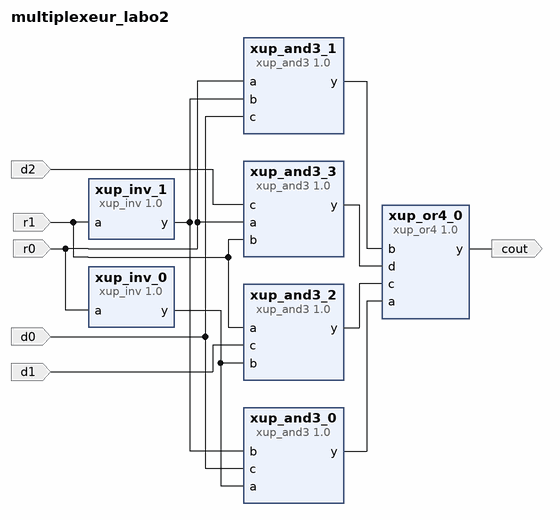
[diagram p0: block diagram of the top level]
# Vivado block design multiplexeur_labo2, xc7a100tcsg324-1, Vivado 2018.3
create_bd_design multiplexeur_labo2

create_bd_port -dir I r0
create_bd_port -dir I r1
create_bd_port -dir I d0
create_bd_port -dir I d1
create_bd_port -dir I d2
create_bd_port -dir O cout

create_bd_cell -type ip -vlnv xilinx.com:xup:xup_and3:1.0 xup_and3_0
create_bd_cell -type ip -vlnv xilinx.com:xup:xup_and3:1.0 xup_and3_1
create_bd_cell -type ip -vlnv xilinx.com:xup:xup_and3:1.0 xup_and3_2
create_bd_cell -type ip -vlnv xilinx.com:xup:xup_and3:1.0 xup_and3_3
create_bd_cell -type ip -vlnv xilinx.com:xup:xup_inv:1.0 xup_inv_0
create_bd_cell -type ip -vlnv xilinx.com:xup:xup_inv:1.0 xup_inv_1
create_bd_cell -type ip -vlnv xilinx.com:xup:xup_or4:1.0 xup_or4_0

# ---- connections ----

connect_bd_net -net r0_1 [get_bd_ports r0] [get_bd_pins xup_inv_0/a] [get_bd_pins xup_and3_3/a] [get_bd_pins xup_and3_1/a]
connect_bd_net [get_bd_pins xup_inv_1/y] [get_bd_pins xup_and3_0/b] [get_bd_pins xup_and3_1/b]
connect_bd_net -net d0_1 [get_bd_ports d0] [get_bd_pins xup_and3_0/c] [get_bd_pins xup_and3_1/c]
connect_bd_net -net d1_1 [get_bd_ports d1] [get_bd_pins xup_and3_2/c]
connect_bd_net -net d2_1 [get_bd_ports d2] [get_bd_pins xup_and3_3/c]
connect_bd_net [get_bd_pins xup_and3_0/y] [get_bd_pins xup_or4_0/a]
connect_bd_net [get_bd_pins xup_and3_1/y] [get_bd_pins xup_or4_0/b]
connect_bd_net [get_bd_pins xup_and3_2/y] [get_bd_pins xup_or4_0/c]
connect_bd_net [get_bd_pins xup_and3_3/y] [get_bd_pins xup_or4_0/d]
connect_bd_net [get_bd_pins xup_or4_0/y] [get_bd_ports cout]
connect_bd_net [get_bd_pins xup_inv_0/y] [get_bd_pins xup_and3_0/a] [get_bd_pins xup_and3_2/b]
connect_bd_net -net r1_1 [get_bd_ports r1] [get_bd_pins xup_inv_1/a] [get_bd_pins xup_and3_2/a] [get_bd_pins xup_and3_3/b]

validate_bd_design
save_bd_design
